# Altium project Slave_brd.PrjPCB
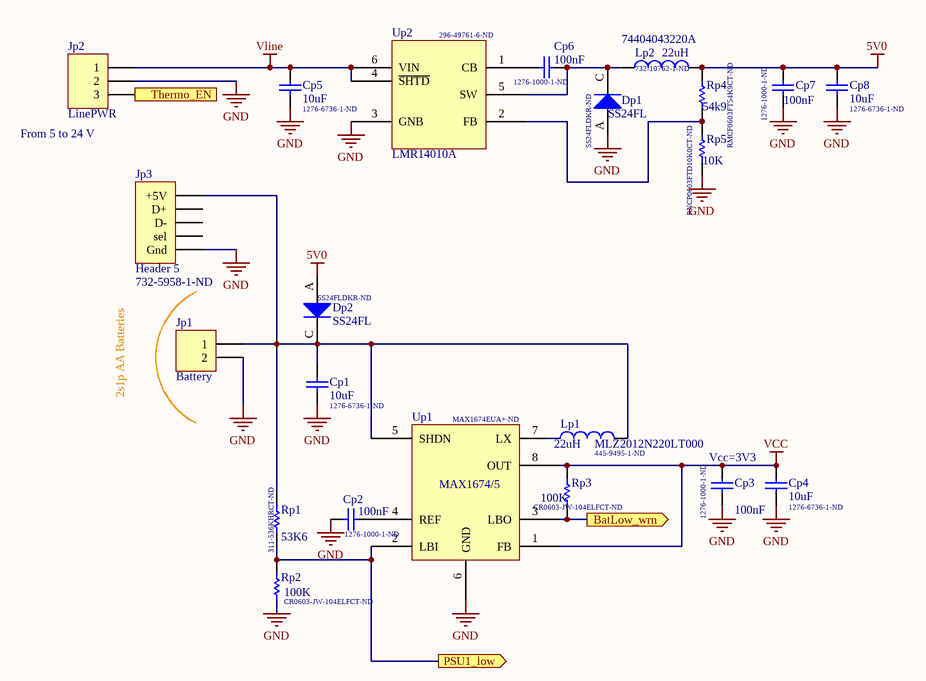
[diagram p0: Pwr.SchDoc]
4 sheets, 96 parts. Net scope: flat (ports and power ports of the same name join across sheets).
Board file: Slave_brd.PcbDoc
Sheets:
  Pwr.SchDoc
  Controls.SchDoc
  Sns.SchDoc
  Actuation.SchDoc

## Sheet Pwr.SchDoc
size A4

### Parts
Cp1  value 10uF  Supplier Part Number 1: 1276-6736-1-ND  [C1206]  (hidden comment: Cap)
Cp2  value 100nF  Supplier Part Number 1: 1276-1000-1-ND  [c0603]  (hidden comment: Cap)
Cp3  value 100nF  Supplier Part Number 1: 1276-1000-1-ND  [c0603]  (hidden comment: Cap)
Cp4  value 10uF  Supplier Part Number 1: 1276-6736-1-ND  [C1206]  (hidden comment: Cap)
Cp5  value 10uF  Supplier Part Number 1: 1276-6736-1-ND  [C1206]  (hidden comment: Cap)
Cp6  value 100nF  Supplier Part Number 1: 1276-1000-1-ND  [c0603]  (hidden comment: Cap)
Cp7  value 100nF  Supplier Part Number 1: 1276-1000-1-ND  [c0603]  (hidden comment: Cap)
Cp8  value 10uF  Supplier Part Number 1: 1276-6736-1-ND  [C1206]  (hidden comment: Cap)
Dp1  SS24FL  Supplier Part Number 1: SS24FLDKR-ND  [SOD123F]
Dp2  SS24FL  Supplier Part Number 1: SS24FLDKR-ND  [SOD123F]
Jp1  Battery  [HDR1X2]
Jp2  LinePWR  [HDR1X3]
Jp3  Header 5  Supplier Part Number 1: 732-5958-1-ND  [614105150721]
Lp1  MLZ2012N220LT000  value 22uH  Supplier Part Number 1: 445-9495-1-ND  [6-0805_L]
Lp2  74404043220A  value 22uH  Supplier Part Number 1: 732-10762-1-ND  [WE_ind_4x4]
Rp1  value 53K6  Supplier Part Number 1: 311-536KHRCT-ND  [r0603]  (hidden comment: Res1)
Rp2  value 100K  Supplier Part Number 1: CR0603-JW-104ELFCT-ND  [r0603]  (hidden comment: Res1)
Rp3  value 100K  Supplier Part Number 1: CR0603-JW-104ELFCT-ND  [r0603]  (hidden comment: Res1)
Rp4  value 54k9  Supplier Part Number 1: RMCF0603FT54K9CT-ND  [r0603]  (hidden comment: Res1)
Rp5  value 10K  Supplier Part Number 1: RNCP0603FTD10K0CT-ND  [r0603]  (hidden comment: Res1)
Up1  Supplier Part Number 1: MAX1674EUA+-ND  [MSOP-8_TermalPad]  (hidden comment: MAX1674/5)
Up2  LMR14010A  Supplier Part Number 1: 296-49761-6-ND  [SOT23-6]

### Ports
BatLow_wrn (out), PSU1_low (out), Thermo_EN

### Nets
5V0: Cp7.1 Cp8.2 Dp2.A Lp2.2 Rp4.2
GND: Cp1.1 Cp2.2 Cp3.2 Cp4.1 Cp5.1 Cp7.2 Cp8.1 Dp1.A Jp1.2 Jp2.2 Jp3.1(Gnd) Rp2.1 Rp5.1 Up1.6(GND) Up2.3(GNB)
VCC: Cp3.1 Cp4.2 Rp3.2 Up1.1(FB) Up1.8(OUT)
Vline: Cp5.2 Jp2.1 Up2.4(~{SHTD}) Up2.6(VIN)
PSU1_low: Rp1.1 Rp2.2 Up1.2(LBI) ; port PSU1_low
NetCp1_2: Cp1.2 Dp2.C(K) Jp1.1 Jp3.5(+5V) Lp1.2 Rp1.2 Up1.5(SHDN)
NetCp2_1: Cp2.1 Up1.4(REF)
NetCp6_1: Cp6.1 Up2.1(CB)
NetCp6_2: Cp6.2 Dp1.C(K) Lp2.1 Up2.5(SW)
NetJp2_3: Jp2.3 ; port Thermo_EN
NetLp1_1: Lp1.1 Up1.7(LX)
NetRp3_1: Rp3.1 Up1.3(LBO) ; port BatLow_wrn
NetRp4_1: Rp4.1 Rp5.2 Up2.2(FB)

Not connected (* = marked no-connect by the designer): Jp3 2(sel) 3(D-) 4(D+)

### Notes on the sheet
- (near Jp2) From 5 to 24 V
- 2s1p AA Batteries
- (near Cp3) Vcc=3V3

### Library data of the parts
Cp1-Cp8 = Cap: Capacitor; Published: 8-Jun-2000; LatestRevisionDate: 17-Jul-2002; LatestRevisionNote: Re-released for DXP Platform.; PackageReference: RAD-0.3; Publisher: Altium Limited; PackageDescription: Radial Cap, Thru-Hole; 2 Leads; 0.3 in Pin Spacing; Supplier 1: Digi-Key
Dp1 Dp2 = Diode: Default Diode; Published: 8-Jun-2000; LatestRevisionDate: 17-Jul-2002; LatestRevisionNote: Re-released for DXP Platform.; PackageVersion: Sep-1996; PackageReference: SMC; Publisher: Altium Limited; PackageDescription: DO-214-AB/SMC; 2 C-Bend Leads; Body 7.9 x 5.9 mm, inc. leads (LxW); Code_JEDEC: DO-214-AB; Supplier 1: Digi-Key
Jp1 = Header 2: Header, 2-Pin; LatestRevisionDate: 17-Jul-2002; LatestRevisionNote: Re-released for DXP Platform.; Publisher: Altium Limited
Jp2 = Header 3: Header, 3-Pin; LatestRevisionDate: 17-Jul-2002; LatestRevisionNote: Re-released for DXP Platform.; Publisher: Altium Limited
Jp3 = Header 5: Header, 5-Pin; LatestRevisionDate: 17-Jul-2002; LatestRevisionNote: Re-released for DXP Platform.; Publisher: Altium Limited; Supplier 1: Digi-Key
Lp1 Lp2 = Inductor: Code_IEC: 1005; Published: 8-Jun-2000; LatestRevisionDate: 29-May-2009; LatestRevisionNote: IPC-7351 Footprint Added.; PackageReference: 0402-A; Publisher: Altium Limited; PackageDescription: Chip Inductor; Code_JEITA: 0402; Supplier 1: Digi-Key
Rp1-Rp5 = Res1: Resistor; Published: 8-Jun-2000; LatestRevisionDate: 17-Jul-2002; LatestRevisionNote: Re-released for DXP Platform.; PackageReference: AXIAL-0.3; Publisher: Altium Limited; PackageDescription: Axial Device, Thru-Hole; 2 Leads; 0.3 in Pin Spacing; Supplier 1: Digi-Key
Up1 = MAX1674/5: High-Efficiency, Low-Supply-Current, / Compact, Step-Up DC-DC Converters; ComponentLink1Description: Datasheet; ComponentLink1URL: https://datasheets.maximintegrated.com/en/ds/MAX1674-MAX1676.pdf; Supplier 1: Digi-Key
Up2 = LMR14010A: LMR14010A 4-V to 40-V, 1-A Step-Down Converter With High Efficiency Eco-mode; ComponentLink1Description: Datasheet; ComponentLink1URL: http://www.ti.com/lit/ds/symlink/lmr14010a.pdf; Supplier 1: Digi-Key

## Sheet Controls.SchDoc
size A4
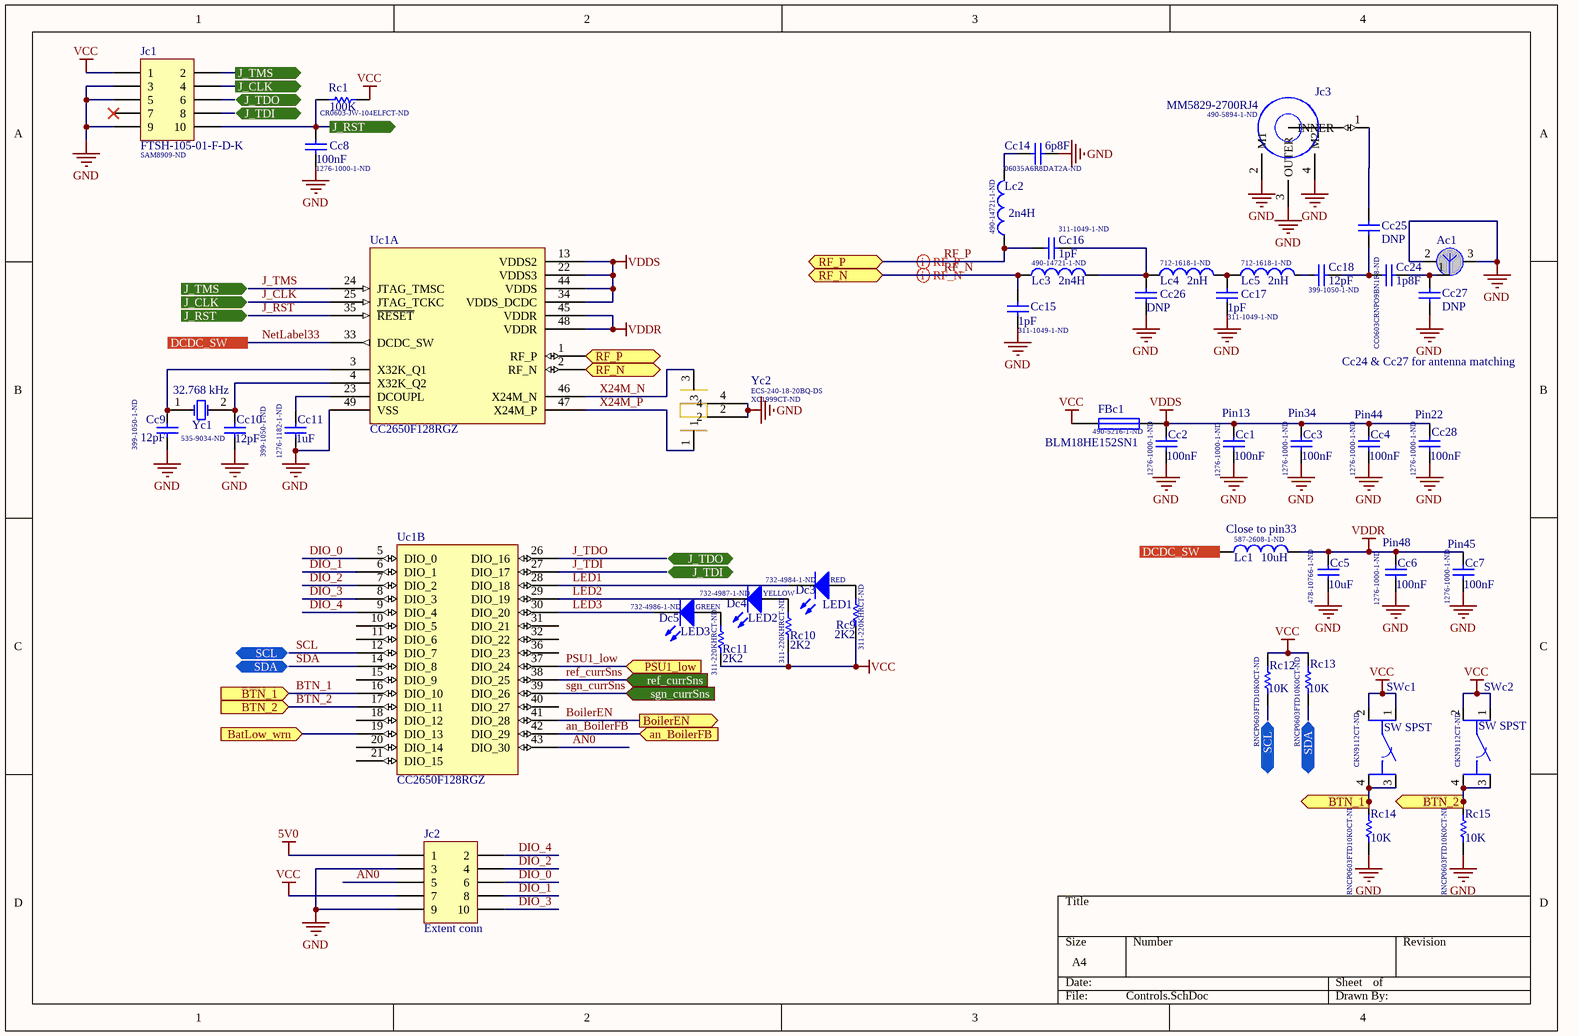
[diagram p1: Controls.SchDoc]

### Parts
Ac1  Generic antenna 3 poles  [2.4-GHz Inverted F Antenna]  (value not drawn)  (no BOM)
Cc1  value 100nF  Supplier Part Number 1: 1276-1000-1-ND  [c0603]  (hidden comment: Cap)
Cc2  value 100nF  Supplier Part Number 1: 1276-1000-1-ND  [c0603]  (hidden comment: Cap)
Cc3  value 100nF  Supplier Part Number 1: 1276-1000-1-ND  [c0603]  (hidden comment: Cap)
Cc4  value 100nF  Supplier Part Number 1: 1276-1000-1-ND  [c0603]  (hidden comment: Cap)
Cc5  value 10uF  Supplier Part Number 1: 478-10766-1-ND  [c0603]  (hidden comment: Cap)
Cc6  value 100nF  Supplier Part Number 1: 1276-1000-1-ND  [c0603]  (hidden comment: Cap)
Cc7  value 100nF  Supplier Part Number 1: 1276-1000-1-ND  [c0603]  (hidden comment: Cap)
Cc8  value 100nF  Supplier Part Number 1: 1276-1000-1-ND  [c0603]  (hidden comment: Cap)
Cc9  value 12pF  Supplier Part Number 1: 399-1050-1-ND  [c0603]  (hidden comment: Cap)
Cc10  value 12pF  Supplier Part Number 1: 399-1050-1-ND  [c0603]  (hidden comment: Cap)
Cc11  value 1uF  Supplier Part Number 1: 1276-1182-1-ND  [c0603]  (hidden comment: Cap)
Cc14  value 6p8F  Supplier Part Number 1: 06035A6R8DAT2A-ND  [c0603]  (hidden comment: Cap)
Cc15  value 1pF  Supplier Part Number 1: 311-1049-1-ND  [c0603]  (hidden comment: Cap)
Cc16  value 1pF  Supplier Part Number 1: 311-1049-1-ND  [c0603]  (hidden comment: Cap)
Cc17  value 1pF  Supplier Part Number 1: 311-1049-1-ND  [c0603]  (hidden comment: Cap)
Cc18  value 12pF  Supplier Part Number 1: 399-1050-1-ND  [c0603]  (hidden comment: Cap)
Cc24  value 1p8F  Supplier Part Number 1: CC0603CRNPO9BN1R8-ND  [c0603]  (hidden comment: Cap)
Cc25  value DNP  [c0603]  (hidden comment: Cap)
Cc26  value DNP  [c0603]  (hidden comment: Cap)
Cc27  value DNP  [c0603]  (hidden comment: Cap)
Cc28  value 100nF  Supplier Part Number 1: 1276-1000-1-ND  [c0603]  (hidden comment: Cap)
Dc3  LED1  Supplier Part Number 1: 732-4984-1-ND  [LED_0805]
Dc4  LED2  Supplier Part Number 1: 732-4987-1-ND  [LED_0805]
Dc5  LED3  Supplier Part Number 1: 732-4986-1-ND  [LED_0805]
FBc1  BLM18HE152SN1  Supplier Part Number 1: 490-5216-1-ND  [r0603]
Jc1  FTSH-105-01-F-D-K  Supplier Part Number 1: SAM8909-ND  [*FTSH-105-01-F-D-K]
Jc2  Extent conn  [HDR2X5]
Jc3  MM5829-2700RJ4  Supplier Part Number 1: 490-5894-1-ND  [ANT_MM5829-2700RJ4]
Lc1  value 10uH  Supplier Part Number 1: 587-2608-1-ND  [FBead0805]  (hidden comment: Inductor)
Lc2  value 2n4H  Supplier Part Number 1: 490-14721-1-ND  [r0603]  (hidden comment: Inductor)
Lc3  value 2n4H  Supplier Part Number 1: 490-14721-1-ND  [r0603]  (hidden comment: Inductor)
Lc4  value 2nH  Supplier Part Number 1: 712-1618-1-ND  [r0603]  (hidden comment: Inductor)
Lc5  value 2nH  Supplier Part Number 1: 712-1618-1-ND  [r0603]  (hidden comment: Inductor)
Rc1  value 100K  Supplier Part Number 1: CR0603-JW-104ELFCT-ND  [r0603]  (hidden comment: Res1)
Rc9  value 2K2  Supplier Part Number 1: 311-220KHRCT-ND  [r0603]  (hidden comment: Res1)
Rc10  value 2K2  Supplier Part Number 1: 311-220KHRCT-ND  [r0603]  (hidden comment: Res1)
Rc11  value 2K2  Supplier Part Number 1: 311-220KHRCT-ND  [r0603]  (hidden comment: Res1)
Rc12  value 10K  Supplier Part Number 1: RNCP0603FTD10K0CT-ND  [r0603]  (hidden comment: Res1)
Rc13  value 10K  Supplier Part Number 1: RNCP0603FTD10K0CT-ND  [r0603]  (hidden comment: Res1)
Rc14  value 10K  Supplier Part Number 1: RNCP0603FTD10K0CT-ND  [r0603]  (hidden comment: Res1)
Rc15  value 10K  Supplier Part Number 1: RNCP0603FTD10K0CT-ND  [r0603]  (hidden comment: Res1)
SWc1  SW SPST  Supplier Part Number 1: CKN9112CT-ND  [SWITCH TACTILE SPST-NO]
SWc2  SW SPST  Supplier Part Number 1: CKN9112CT-ND  [SWITCH TACTILE SPST-NO]
Uc1  CC2650F128RGZ  [VQFN-48(RGZ)]  (parts A,B of 2)
Yc1  32.768 kHz  Supplier Part Number 1: 535-9034-ND  [XTAL_AB38T-32.768KHZ_TH_vertical]
Yc2  ECS-240-18-20BQ-DS  Supplier Part Number 1: XC1999CT-ND  [XTAL_7x5_4pads]

### Ports
an_BoilerFB (in), BatLow_wrn (in), BoilerEN (out), BTN_1 (in), BTN_1 (out), BTN_2 (in), BTN_2 (out), DCDC_SW, J_CLK (in), J_CLK (out), J_RST (in), J_RST (out), J_TDI (bidir), J_TDO (bidir), J_TMS (in), J_TMS (out), PSU1_low (in), ref_currSns (in), RF_N (bidir), RF_P (bidir), SCL (bidir), SDA (bidir), sgn_currSns (in)

### Nets
5V0: Jc2.1
GND: Ac1.2 Ac1.3 Cc1.1 Cc2.1 Cc3.1 Cc4.1 Cc5.1 Cc6.1 Cc7.1 Cc8.1 Cc9.1 Cc10.2 Cc11.2 Cc14.2 Cc15.1 Cc17.1 Cc26.1 Cc27.2 Cc28.1 Jc1.3 Jc1.5 Jc1.9 Jc2.3 Jc2.9 Jc3.2(M1) Jc3.3(OUTER) Jc3.4(M2) Rc14.1 Rc15.1 Uc1.49(VSS) Yc2.2 Yc2.4
VCC: FBc1.2 Jc1.1 Jc2.7 Rc1.2 Rc9.1 Rc10.1 Rc11.1 Rc12.2 Rc13.2 SWc1.1 SWc1.2 SWc2.1 SWc2.2
VDDR: Cc5.2 Cc6.2 Cc7.2 Lc1.2 Uc1.45(VDDR) Uc1.48(VDDR)
VDDS: Cc1.2 Cc2.2 Cc3.2 Cc4.2 Cc28.2 FBc1.1 Uc1.13(VDDS2) Uc1.22(VDDS3) Uc1.34(VDDS_DCDC) Uc1.44(VDDS)
AN0: Jc2.5 Uc1.43(DIO_30)
an_BoilerFB: Uc1.42(DIO_29) ; port an_BoilerFB
BoilerEN: Uc1.41(DIO_28) ; port BoilerEN
BTN_1: Rc14.2 SWc1.3 SWc1.4 Uc1.16(DIO_10) ; port BTN_1
BTN_2: Rc15.2 SWc2.3 SWc2.4 Uc1.17(DIO_11) ; port BTN_2
DIO_0: Jc2.6 Uc1.5(DIO_0)
DIO_1: Jc2.8 Uc1.6(DIO_1)
DIO_2: Jc2.4 Uc1.7(DIO_2)
DIO_3: Jc2.10 Uc1.8(DIO_3)
DIO_4: Jc2.2 Uc1.9(DIO_4)
J_CLK: Jc1.4 Uc1.25(JTAG_TCKC) ; port J_CLK
J_RST: Cc8.2 Jc1.10 Rc1.1 Uc1.35(~{RESET}) ; port J_RST
J_TDI: Jc1.8 Uc1.27(DIO_17) ; port J_TDI
J_TDO: Jc1.6 Uc1.26(DIO_16) ; port J_TDO
J_TMS: Jc1.2 Uc1.24(JTAG_TMSC) ; port J_TMS
LED1: Dc3.2(K) Uc1.28(DIO_18)
LED2: Dc4.2(K) Uc1.29(DIO_19)
LED3: Dc5.2(K) Uc1.30(DIO_20)
NetLabel33: Lc1.1 Uc1.33(DCDC_SW) ; port DCDC_SW
PSU1_low: Uc1.37(DIO_24) ; port PSU1_low
ref_currSns: Uc1.38(DIO_25) ; port ref_currSns
RF_N: Cc15.2 Lc3.1 Uc1.2(RF_N) ; port RF_N
RF_P: Cc16.1 Lc2.1 Uc1.1(RF_P) ; port RF_P
SCL: Rc12.1 Uc1.12(DIO_7) ; port SCL
SDA: Rc13.1 Uc1.14(DIO_8) ; port SDA
sgn_currSns: Uc1.39(DIO_26) ; port sgn_currSns
X24M_N: Uc1.46(X24M_N) Yc2.3
X24M_P: Uc1.47(X24M_P) Yc2.1
NetAc1_1: Ac1.1 Cc24.1 Cc27.1
NetCc9_2: Cc9.2 Uc1.3(X32K_Q1) Yc1.1(OSC1)
NetCc10_1: Cc10.1 Uc1.4(X32K_Q2) Yc1.2(OSC2)
NetCc11_1: Cc11.1 Uc1.23(DCOUPL)
NetCc14_1: Cc14.1 Lc2.2
NetCc16_2: Cc16.2 Cc26.2 Lc3.2 Lc4.1
NetCc17_2: Cc17.2 Lc4.2 Lc5.1
NetCc18_1: Cc18.1 Cc24.2 Cc25.2
NetCc18_2: Cc18.2 Lc5.2
NetCc25_1: Cc25.1 Jc3.1(INNER)
NetDc3_1: Dc3.1(A) Rc9.2
NetDc4_1: Dc4.1(A) Rc10.2
NetDc5_1: Dc5.1(A) Rc11.2
NetRp3_1: Uc1.19(DIO_13) ; port BatLow_wrn

Not connected (* = marked no-connect by the designer): Jc1 7*; Uc1 10(DIO_5) 11(DIO_6) 15(DIO_9) 18(DIO_12) 20(DIO_14) 21(DIO_15) 31(DIO_21) 32(DIO_22) 36(DIO_23) 40(DIO_27)

### Layout directives
differential pair: RF_N, RF_P

### Notes on the sheet
- Cc24 & Cc27 for antenna matching
- (near Cc1) Pin13
- (near Cc3) Pin34
- (near Cc4) Pin44
- (near Cc28) Pin22
- (near Dc3) RED
- (near Lc1) Close to pin33
- (near Cc6) Pin48
- (near Cc7) Pin45
- (near Dc5) GREEN
- (near Dc4) YELLOW

### Library data of the parts
Ac1 = antenna
Cc1-Cc11 Cc14-Cc18 Cc24-Cc28 = Cap: Capacitor; Published: 8-Jun-2000; LatestRevisionDate: 17-Jul-2002; LatestRevisionNote: Re-released for DXP Platform.; PackageReference: RAD-0.3; Publisher: Altium Limited; PackageDescription: Radial Cap, Thru-Hole; 2 Leads; 0.3 in Pin Spacing
  Cc1-Cc10 Cc14 Cc16-Cc18 Cc24 Cc28: Supplier 1: Digi-Key
  Cc11: Supplier 1: Digi-Key; Supplier 2: Digi-Key; Supplier Part Number 2: 1276-1182-1-ND
  Cc15: Supplier 1: Digi-Key; Supplier 2: Digi-Key; Supplier Part Number 2: 311-1049-1-ND
Dc3-Dc5 = LED0: Typical INFRARED GaAs LED; Published: 8-Jun-2000; LatestRevisionDate: 08-Jul-2005; LatestRevisionNote: Mech Layer 1 removed.; PackageReference: LED-0; Publisher: Altium Limited; PackageDescription: LED; 2 Leads; Supplier 1: Digi-Key
FBc1 = Fuse 1: Fuse; Published: 8-Jun-2000; LatestRevisionDate: 17-Jul-2002; LatestRevisionNote: Re-released for DXP Platform.; PackageReference: PIN-W2/E2.8; Publisher: Altium Limited; PackageDescription: Thru-Hole; 2 Leads; Supplier 1: Digi-Key
Jc1 Jc2 = Header 5X2: Header, 5-Pin, Dual row; LatestRevisionDate: 17-Jul-2002; LatestRevisionNote: Re-released for DXP Platform.; Publisher: Altium Limited
  Jc1: Supplier 1: Digi-Key
Jc3 = MM5829-2700RJ4: Conn Coaxial RCP 0Hz to 12GHz 50Ohm Solder ST SMD Gold; MF: Murata; SnapEDA_Link: https://www.snapeda.com/parts/MM5829-2700RJ4/Murata%20Electronics%20North%20America/view-part/?ref=snap; Digi-Key_Purchase_URL: https://www.digikey.it/product-detail/en/murata-electronics-north-america/MM5829-2700RJ4/490-5894-1-ND/3528184?utm_source=snapeda&utm_medium=aggregator&utm_campaign=symbol; Digi-Key_Part_Number: 490-5894-1-ND; Package: None; MP: MM5829-2700RJ4; Value: *; Supplier 1: Digi-Key
Lc1-Lc5 = Inductor: Code_IEC: 1005; Published: 8-Jun-2000; LatestRevisionDate: 29-May-2009; LatestRevisionNote: IPC-7351 Footprint Added.; PackageReference: 0402-A; Publisher: Altium Limited; PackageDescription: Chip Inductor; Code_JEITA: 0402; Supplier 1: Digi-Key
Rc1 Rc9-Rc15 = Res1: Resistor; Published: 8-Jun-2000; LatestRevisionDate: 17-Jul-2002; LatestRevisionNote: Re-released for DXP Platform.; PackageReference: AXIAL-0.3; Publisher: Altium Limited; PackageDescription: Axial Device, Thru-Hole; 2 Leads; 0.3 in Pin Spacing; Supplier 1: Digi-Key
Uc1 = CC2650F128RGZ: The CC2650 device is a wireless MCU targeting Bluetooth, ZigBee® and 6LoWPAN, and ZigBee RF4CE / remote control applications.; ComponentLink1Description: Datasheet; ComponentLink1URL: http://www.ti.com/product/CC2650
Yc1 = XTAL: Crystal Oscillator; Published: 8-Jun-2000; LatestRevisionDate: 17-Jul-2002; LatestRevisionNote: Re-released for DXP Platform.; PackageReference: R38; Publisher: Altium Limited; PackageDescription: Crystal, Thru-Hole; 2 Leads; Body 3.1 x 8.2 mm (Dia.xH); Supplier 1: Digi-Key
Yc2 = XTAL_4p: MHz Range Crystal Unit Miniature Size Low Profile SMD; Supplier 1: Digi-Key
SWc1 SWc2 = SW SPST: Supplier 1: Digi-Key

## Sheet Sns.SchDoc
size A4
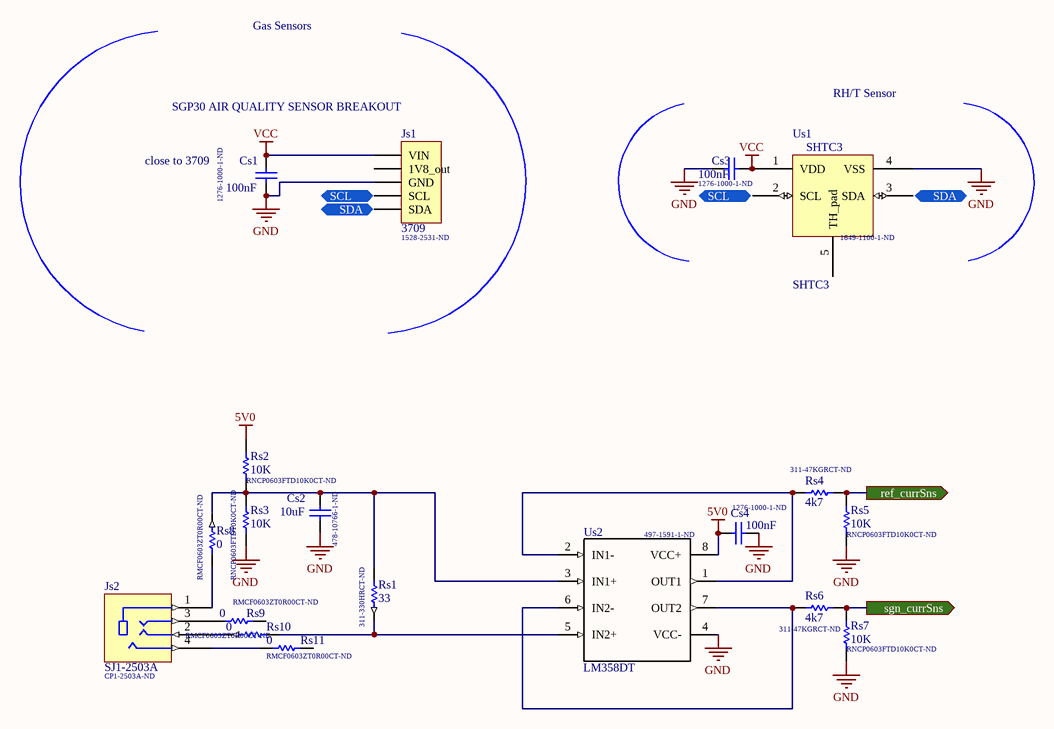
[diagram p2: Sns.SchDoc]

### Parts
Cs1  value 100nF  Supplier Part Number 1: 1276-1000-1-ND  [c0603]  (hidden comment: Cap)
Cs2  value 10uF  Supplier Part Number 1: 478-10766-1-ND  [c0603]  (hidden comment: Cap)
Cs3  value 100nF  Supplier Part Number 1: 1276-1000-1-ND  [c0603]  (hidden comment: Cap)
Cs4  value 100nF  Supplier Part Number 1: 1276-1000-1-ND  [c0603]  (hidden comment: Cap)
Js1  3709  Supplier Part Number 1: 1528-2531-ND  [Adafruit_SGP30_board]
Js2  SJ1-2503A  Supplier Part Number 1: CP1-2503A-ND  [JACK3.5_4DIP_1ancor]
Rs1  value 33  Supplier Part Number 1: 311-330HRCT-ND  [r0603]  (hidden comment: Res1)
Rs2  value 10K  Supplier Part Number 1: RNCP0603FTD10K0CT-ND  [r0603]  (hidden comment: Res1)
Rs3  value 10K  Supplier Part Number 1: RNCP0603FTD10K0CT-ND  [r0603]  (hidden comment: Res1)
Rs4  value 4k7  Supplier Part Number 1: 311-47KGRCT-ND  [r0603]  (hidden comment: Res1)
Rs5  value 10K  Supplier Part Number 1: RNCP0603FTD10K0CT-ND  [r0603]  (hidden comment: Res1)
Rs6  value 4k7  Supplier Part Number 1: 311-47KGRCT-ND  [r0603]  (hidden comment: Res1)
Rs7  value 10K  Supplier Part Number 1: RNCP0603FTD10K0CT-ND  [r0603]  (hidden comment: Res1)
Rs8  value 0  Supplier Part Number 1: RMCF0603ZT0R00CT-ND  [r0603]  (hidden comment: Res1)
Rs9  value 0  Supplier Part Number 1: RMCF0603ZT0R00CT-ND  [r0603]  (hidden comment: Res1)
Rs10  value 0  Supplier Part Number 1: RMCF0603ZT0R00CT-ND  [r0603]  (hidden comment: Res1)
Rs11  value 0  Supplier Part Number 1: RMCF0603ZT0R00CT-ND  [r0603]  (hidden comment: Res1)
Us1  SHTC3  Supplier Part Number 1: 1649-1100-1-ND  [DFN-4]
Us2  LM358DT  Supplier Part Number 1: 497-1591-1-ND  [SO8]

### Ports
ref_currSns (out), SCL (bidir), SDA (bidir), sgn_currSns (out)

### Nets
5V0: Cs4.2 Rs2.1 Us2.8(VCC+)
GND: Cs1.1 Cs2.1 Cs3.2 Cs4.1 Js1.3(GND) Rs3.2 Rs5.2 Rs7.2 Us1.4(VSS) Us2.4(VCC-)
VCC: Cs1.2 Cs3.1 Js1.1(VIN) Us1.1(VDD)
ref_currSns: Rs4.2 Rs5.1 ; port ref_currSns
SCL: Js1.4(SCL) Us1.2(SCL) ; port SCL
SDA: Js1.5(SDA) Us1.3(SDA) ; port SDA
sgn_currSns: Rs6.2 Rs7.1 ; port sgn_currSns
NetCs2_2: Cs2.2 Rs1.1 Rs2.2 Rs3.1 Rs8.1 Us2.3(IN1+)
NetJs2_1: Js2.1 Rs8.2
NetJs2_2: Js2.2 Rs10.1
NetJs2_3: Js2.3 Rs9.1
NetJs2_4: Js2.4 Rs11.1
NetRs1_2: Rs1.2 Rs10.2 Us2.5(IN2+)
NetRs4_1: Rs4.1 Us2.1(OUT1) Us2.2(IN1-)
NetRs6_1: Rs6.1 Us2.6(IN2-) Us2.7(OUT2)

Not connected (* = marked no-connect by the designer): Js1 2(1V8_out); Rs9 2; Rs11 2; Us1 5(TH_pad)

### Notes on the sheet
- Gas Sensors
- SGP30 AIR QUALITY SENSOR BREAKOUT
- RH/T Sensor
- (near Cs1) close to 3709

### Library data of the parts
Cs1-Cs4 = Cap: Capacitor; Published: 8-Jun-2000; LatestRevisionDate: 17-Jul-2002; LatestRevisionNote: Re-released for DXP Platform.; PackageReference: RAD-0.3; Publisher: Altium Limited; PackageDescription: Radial Cap, Thru-Hole; 2 Leads; 0.3 in Pin Spacing; Supplier 1: Digi-Key
Js1 = Header 5: Header, 5-Pin; LatestRevisionDate: 17-Jul-2002; LatestRevisionNote: Re-released for DXP Platform.; Publisher: Altium Limited; ComponentLink1Description: VOC concentration; ComponentLink1URL: https://www.sensirion.com/fileadmin/user_upload/customers/sensirion/Dokumente/9_Gas_Sensors/Sensirion_Gas_Sensors_SGP3x_TVOC_Concept.pdf; Supplier 1: Digi-Key
Js2 = jack3.5_ SJ1-2503A: Supplier 1: Digi-Key
Rs1-Rs11 = Res1: Resistor; Published: 8-Jun-2000; LatestRevisionDate: 17-Jul-2002; LatestRevisionNote: Re-released for DXP Platform.; PackageReference: AXIAL-0.3; Publisher: Altium Limited; PackageDescription: Axial Device, Thru-Hole; 2 Leads; 0.3 in Pin Spacing; Supplier 1: Digi-Key
Us1 = SHTC3: Humidity and Temperature Sensor IC: - Ultra-low power consumption / - Full battery supply voltage range (1.62 - 3.6 V) / - Small DFN package: 2 × 2 × 0.75 mm3 / - Typical accuracy: ±2 %RH and ±0.2 °C / - Fully calibrated and reflow solderable / - Power-up and measurement within 1 ms; ComponentLink1Description: datasheet; ComponentLink1URL: https://www.sensirion.com/fileadmin/user_upload/customers/sensirion/Dokumente/0_Datasheets/Humidity/Sensirion_Humidity_Sensors_SHTC3_Datasheet.pdf; Supplier 1: Digi-Key
Us2 = LM358DT: LM358 Series 30 V 1.1 MHz Low Power Dual Operational Amplifier - SOIC-8; MF: STMicroelectronics; Price: None; Availability: Unavailable; Package: SOIC-8 STMicroelectronics; MP: LM358DT; SnapEDA_Link: https://www.snapeda.com/parts/LM358DT/STMicroelectronics/view-part/?ref=snap; Value: *; Supplier 1: Digi-Key

## Sheet Actuation.SchDoc
size A4
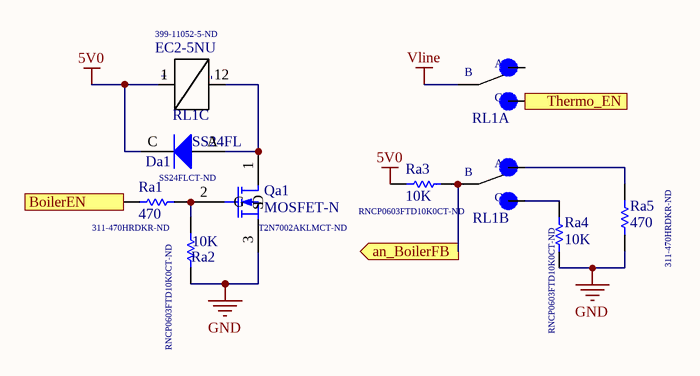
[diagram p3: Actuation.SchDoc]

### Parts
Da1  SS24FL  Supplier Part Number 1: SS24FLCT-ND  [SOD123F]
Qa1  MOSFET-N  Supplier Part Number 1: T2N7002AKLMCT-ND  [SOT23]
Ra1  value 470  Supplier Part Number 1: 311-470HRDKR-ND  [r0603]  (hidden comment: Res1)
Ra2  value 10K  Supplier Part Number 1: RNCP0603FTD10K0CT-ND  [r0603]  (hidden comment: Res1)
Ra3  value 10K  Supplier Part Number 1: RNCP0603FTD10K0CT-ND  [r0603]  (hidden comment: Res1)
Ra4  value 10K  Supplier Part Number 1: RNCP0603FTD10K0CT-ND  [r0603]  (hidden comment: Res1)
Ra5  value 470  Supplier Part Number 1: 311-470HRDKR-ND  [r0603]  (hidden comment: Res1)
RL1  EC2-5NU  [REL_EC2-5NU]  (value not drawn)  (parts A,B,C of 3)

### Ports
an_BoilerFB (out), BoilerEN (in), Thermo_EN

### Nets
5V0: Da1.C(K) Ra3.2 RL1.1(POS)
GND: Qa1.3(S) Ra2.1 Ra4.2 Ra5.2
Vline: RL1.4(B1)
an_BoilerFB: Ra3.1 RL1.9(B) ; port an_BoilerFB
BoilerEN: Ra1.2 ; port BoilerEN
NetDa1_A: Da1.A Qa1.1(D) RL1.12(NEG)
NetJp2_3: RL1.5(C1) ; port Thermo_EN
NetQa1_2: Qa1.2(G) Ra1.1 Ra2.2
NetRa4_1: Ra4.1 RL1.8(C)
NetRa5_1: Ra5.1 RL1.10(A)

Not connected (* = marked no-connect by the designer): RL1 3(A1)

### Notes on the sheet
- (in symbol EC2-5NU, part A) A; B; C
- (in symbol EC2-5NU, part C) +; -

### Library data of the parts
Da1 = Diode: Default Diode; Published: 8-Jun-2000; LatestRevisionDate: 17-Jul-2002; LatestRevisionNote: Re-released for DXP Platform.; PackageVersion: Sep-1996; PackageReference: SMC; Publisher: Altium Limited; PackageDescription: DO-214-AB/SMC; 2 C-Bend Leads; Body 7.9 x 5.9 mm, inc. leads (LxW); Code_JEDEC: DO-214-AB; Supplier 1: Digi-Key
Qa1 = MOSFET-N: N-Channel MOSFET; Published: 8-Jun-2000; LatestRevisionDate: 17-Jul-2002; LatestRevisionNote: Re-released for DXP Platform.; PackageVersion: 1995/1996; PackageReference: E3; Publisher: Altium Limited; PackageDescription: TO, Flat Index; 3 In-Line, Axial Leads; Body Dia. 4.6mm; Lead Dia. 0.5 mm (max); Supplier 1: Digi-Key
Ra1-Ra5 = Res1: Resistor; Published: 8-Jun-2000; LatestRevisionDate: 17-Jul-2002; LatestRevisionNote: Re-released for DXP Platform.; PackageReference: AXIAL-0.3; Publisher: Altium Limited; PackageDescription: Axial Device, Thru-Hole; 2 Leads; 0.3 in Pin Spacing; Supplier 1: Digi-Key
RL1 = EC2-5NU: Electromechanical Relay DPDT 2A 5VDC 178Ohm Through Hole; MF: KEMET; Price: None; MP: EC2-5NU; Package: None; Availability: Unavailable; SnapEDA_Link: https://www.snapeda.com/parts/EC2-5NU/KEMET/view-part/?ref=snap; Value: *

## Nets that join several sheets
5V0: Pwr (5 pins), Controls (Jc2.1), Sns (Cs4.2 Rs2.1 Us2.8), Actuation (Da1.C Ra3.2 RL1.1)
GND: Pwr (15 pins), Controls (32 pins), Sns (10 pins), Actuation (Qa1.3 Ra2.1 Ra4.2 Ra5.2)
VCC: Pwr (5 pins), Controls (13 pins), Sns (Cs1.2 Cs3.1 Js1.1 Us1.1)
Vline: Pwr (Cp5.2 Jp2.1 Up2.4 Up2.6), Actuation (RL1.4)
an_BoilerFB: Controls (Uc1.42), Actuation (Ra3.1 RL1.9)
BoilerEN: Controls (Uc1.41), Actuation (Ra1.2)
NetJp2_3: Pwr (Jp2.3), Actuation (RL1.5)
NetRp3_1: Pwr (Rp3.1 Up1.3), Controls (Uc1.19)
PSU1_low: Pwr (Rp1.1 Rp2.2 Up1.2), Controls (Uc1.37)
ref_currSns: Controls (Uc1.38), Sns (Rs4.2 Rs5.1)
SCL: Controls (Rc12.1 Uc1.12), Sns (Js1.4 Us1.2)
SDA: Controls (Rc13.1 Uc1.14), Sns (Js1.5 Us1.3)
sgn_currSns: Controls (Uc1.39), Sns (Rs6.2 Rs7.1)